# EAGLE design JJ BLDC v0.2b (EAGLE 7.2.0)
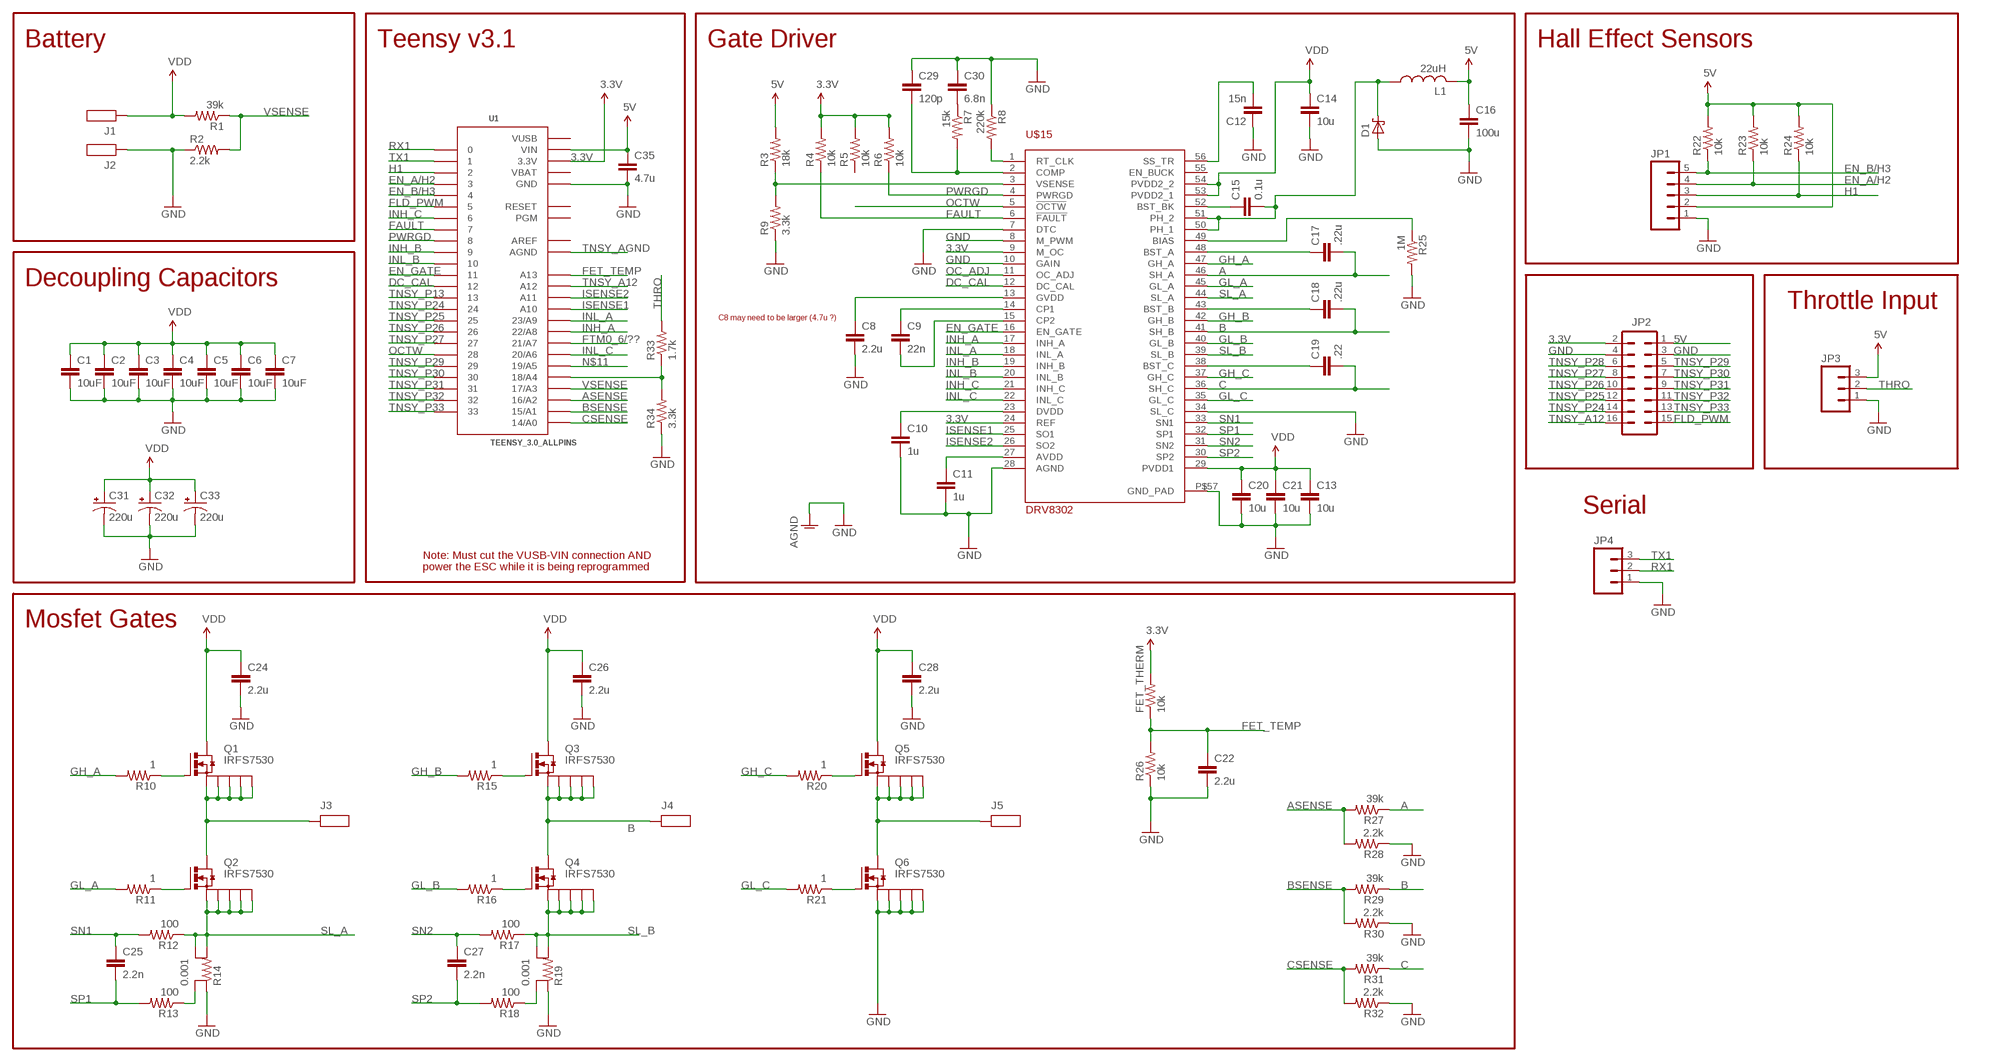
[diagram p0: schematic, sheet 1]

## Parts
C1  10uF  CAP1206  [1206]
C2  10uF  CAP1206  [1206]
C3  10uF  CAP1206  [1206]
C4  10uF  CAP1206  [1206]
C5  10uF  CAP1206  [1206]
C6  10uF  CAP1206  [1206]
C7  10uF  CAP1206  [1206]
C8  2.2u  CAP0603-CAP  [0603-CAP]
C9  22n  CAP0603-CAP  [0603-CAP]
C10  1u  CAP0603-CAP  [0603-CAP]
C11  1u  CAP0603-CAP  [0603-CAP]
C12  15n  CAP0603-CAP  [0603-CAP]
C13  10u  CAP0805  [0805]
C14  10u  CAP0805  [0805]
C15  0.1u  CAP0603-CAP  [0603-CAP]
C16  100u  CAP0805  [0805]
C17  .22u  CAP0603-CAP  [0603-CAP]
C18  .22u  CAP0603-CAP  [0603-CAP]
C19  .22  CAP0603-CAP  [0603-CAP]
C20  10u  CAP0603-CAP  [0603-CAP]
C21  10u  CAP0805  [0805]
C22  2.2u  CAP0603-CAP  [0603-CAP]
C24  2.2u  CAP1206  [1206]
C25  2.2n  CAP0603-CAP  [0603-CAP]
C26  2.2u  CAP1206  [1206]
C27  2.2n  CAP0603-CAP  [0603-CAP]
C28  2.2u  CAP1206  [1206]
C29  120p  CAP0603-CAP  [0603-CAP]
C30  6.8n  CAP0603-CAP  [0603-CAP]
C31  220u  CPOL-USE5-10.5  [E5-10,5]
C32  220u  CPOL-USE5-10.5  [E5-10,5]
C33  220u  CPOL-USE5-10.5  [E5-10,5]
C35  4.7u  CAP0603-CAP  [0603-CAP]
D1  SCHOTTKY_SMA  [SMA]
FET_THERM  10k  RESISTOR0603  [0603-RES]
J1  WIREPAD_SMD_10X4  [WIREPAD_SMD_10X4]
J2  WIREPAD_SMD_10X4  [WIREPAD_SMD_10X4]
J3  WIREPAD_SMD_10X4  [WIREPAD_SMD_10X4]
J4  WIREPAD_SMD_10X4  [WIREPAD_SMD_10X4]
J5  WIREPAD_SMD_10X4  [WIREPAD_SMD_10X4]
JP1  M05PTH  [1X05]
JP2  M08X2  [2X8]
JP3  M03PTH  [1X03]
JP4  M03PTH  [1X03]
L1  22uH  L-USL5650M  [L5650M]
Q1  IRFS7530  [TO-263-7]
Q2  IRFS7530  [TO-263-7]
Q3  IRFS7530  [TO-263-7]
Q4  IRFS7530  [TO-263-7]
Q5  IRFS7530  [TO-263-7]
Q6  IRFS7530  [TO-263-7]
R1  39k  RESISTOR0603  [0603-RES]
R2  2.2k  RESISTOR0603  [0603-RES]
R3  18k  RESISTOR0603  [0603-RES]
R4  10k  RESISTOR0603  [0603-RES]
R5  10k  RESISTOR0603  [0603-RES]
R6  10k  RESISTOR0603  [0603-RES]
R7  15k  RESISTOR0603  [0603-RES]
R8  220k  RESISTOR0603  [0603-RES]
R9  3.3k  RESISTOR0603  [0603-RES]
R10  1  RESISTOR0603  [0603-RES]
R11  1  RESISTOR0603  [0603-RES]
R12  100  RESISTOR0603  [0603-RES]
R13  100  RESISTOR0603  [0603-RES]
R14  0.001  WSLP2726_SHUNT  [SHUNT-RES-2726]
R15  1  RESISTOR0603  [0603-RES]
R16  1  RESISTOR0603  [0603-RES]
R17  100  RESISTOR0603  [0603-RES]
R18  100  RESISTOR0603  [0603-RES]
R19  0.001  WSLP2726_SHUNT  [SHUNT-RES-2726]
R20  1  RESISTOR0603  [0603-RES]
R21  1  RESISTOR0603  [0603-RES]
R22  10k  RESISTOR0603  [0603-RES]
R23  10k  RESISTOR0603  [0603-RES]
R24  10k  RESISTOR0603  [0603-RES]
R25  1M  RESISTOR0603  [0603-RES]
R26  10k  RESISTOR0603  [0603-RES]
R27  39k  RESISTOR0603  [0603-RES]
R28  2.2k  RESISTOR0603  [0603-RES]
R29  39k  RESISTOR0603  [0603-RES]
R30  2.2k  RESISTOR0603  [0603-RES]
R31  39k  RESISTOR0603  [0603-RES]
R32  2.2k  RESISTOR0603  [0603-RES]
R33  1.7k  RESISTOR0603  [0603-RES]
R34  3.3k  RESISTOR0603  [0603-RES]
U1  TEENSY_3.0_ALLPINS  [TEENSY_3.0_ALLPINS]
U$15  DRV8302  [HTSSOP-56]

## Nets
3.3V: FET_THERM.2 JP2.2 R4.2 R5.2 R6.2 U1.3.3V U1.3.3V1(3.3V) U1.3.3V2(3.3V) U$15.9(M_OC) U$15.24(REF)
5V: C16.1 C35.1 JP1.2 JP2.1 JP3.3 L1.2 R3.2 R22.2 R23.2 R24.2 U1.VIN
A: C17.2 J3.P$1 Q1.2(S1) Q1.3(S2) Q1.5(S3) Q1.6(S4) Q1.7(S) Q2.4(D) R27.1 U$15.46(SH_A)
ASENSE: R27.2 R28.2 U1.16/A2
B: C18.2 J4.P$1 Q3.2(S1) Q3.3(S2) Q3.5(S3) Q3.6(S4) Q3.7(S) Q4.4(D) R29.1 U$15.41(SH_B)
BSENSE: R29.2 R30.2 U1.15/A1
C: C19.2 J5.P$1 Q5.2(S1) Q5.3(S2) Q5.5(S3) Q5.6(S4) Q5.7(S) Q6.4(D) R31.1 U$15.36(SH_C)
CSENSE: R31.2 R32.2 U1.14/A0
DC_CAL: U1.12 U$15.12(DC_CAL)
EN_A/H2: JP1.4 R23.1 U1.3
EN_B/H3: JP1.5 R22.1 U1.4
EN_GATE: U1.11 U$15.16(EN_GATE)
FAULT: R4.1 U1.7 U$15.6(!FAULT)
FET_TEMP: C22.1 FET_THERM.1 R26.2 U1.A13
FLD_PWM: JP2.15 U1.5
FTM0_6/??: U1.21/A7
GH_A: R10.2 U$15.47(GH_A)
GH_B: R15.2 U$15.42(GH_B)
GH_C: R20.2 U$15.37(GH_C)
GL_A: R11.2 U$15.45(GL_A)
GL_A': Q2.1(G) R11.1
GL_B: R16.2 U$15.40(GL_B)
GL_B': Q4.1(G) R16.1
GL_C: R21.2 U$15.35(GL_C)
GL_C': Q6.1(G) R21.1
GND: C1.2 C2.2 C3.2 C4.2 C5.2 C6.2 C7.2 C8.2 C10.2 C11.2 C12.1 C13.2 C14.2 C16.2 C20.2 C21.2 C22.2 C24.2 C26.2 C28.2 C29.1 C30.1 C31.- C32.- C33.- C35.2 D1.A J2.P$1 JP1.1 JP2.3 JP2.4 JP3.1 JP4.1 Q6.2(S1) Q6.3(S2) Q6.5(S3) Q6.6(S4) Q6.7(S) R2.1 R8.1 R9.1 R14.P$1 R19.P$1 R25.2 R26.1 R28.1 R30.1 R32.1 R34.1 U1.GND U1.GND1(GND) U1.GND2(GND) U$15.7(DTC) U$15.8(M_PWM) U$15.10(GAIN) U$15.28(AGND) U$15.34(SL_C) U$15.P$57(GND_PAD) ; supply symbol labelled AGND
H1: JP1.3 R24.1 U1.2
INH_A: U1.22/A8 U$15.17(INH_A)
INH_B: U1.9 U$15.19(INH_B)
INH_C: U1.6 U$15.21(INH_C)
INL_A: U1.23/A9 U$15.18(INL_A)
INL_B: U1.10 U$15.20(INL_B)
INL_C: U1.20/A6 U$15.22(INL_C)
ISENSE1: U1.A10 U$15.25(SO1)
ISENSE2: U1.A11 U$15.26(SO2)
N$1: Q3.1(G) R15.1
N$2: R3.1 R9.2 U$15.3(VSENSE)
N$3: C29.2 R7.2 U$15.2(COMP)
N$4: C10.1 U$15.23(DVDD)
N$5: Q5.1(G) R20.1
N$6: C12.2 U$15.56(SS_TR)
N$7: C30.2 R7.1
N$8: C15.1 U$15.52(BST_BK)
N$9: Q1.1(G) R10.1
N$10: R8.2 U$15.1(RT_CLK)
N$11: U1.19/A5
N$12: R25.1 U$15.49(BIAS)
N$13: R33.1 R34.2 U1.18/A4
N$15: R13.1 R14.P$3
N$16: R18.1 R19.P$3
N$28: C19.1 U$15.38(BST_C)
N$30: C9.1 U$15.14(CP1)
N$31: C11.1 U$15.27(AVDD)
N$32: C9.2 U$15.15(CP2)
N$33: C8.1 U$15.13(GVDD)
N$34: C18.1 U$15.43(BST_B)
N$44: C17.1 U$15.48(BST_A)
N$47: C15.2 D1.C L1.1 U$15.50(PH_1) U$15.51(PH_2)
OC_ADJ: U$15.11(OC_ADJ)
OCTW: U1.28 U$15.5(!OCTW)
PWRGD: R6.1 U1.8 U$15.4(PWRGD)
RX1: JP4.2 U1.0
SL_A: Q2.2(S1) Q2.3(S2) Q2.5(S3) Q2.6(S4) Q2.7(S) R12.1 R14.P$2 R14.P$4 U$15.44(SL_A)
SL_B: Q4.2(S1) Q4.3(S2) Q4.5(S3) Q4.6(S4) Q4.7(S) R17.1 R19.P$2 R19.P$4 U$15.39(SL_B)
SN1: C25.1 R12.2 U$15.33(SN1)
SN2: C27.1 R17.2 U$15.31(SN2)
SP1: C25.2 R13.2 U$15.32(SP1)
SP2: C27.2 R18.2 U$15.30(SP2)
THRO: JP3.2 R33.2
TNSY_A12: JP2.16 U1.A12
TNSY_AGND: U1.AGND
TNSY_P13: U1.13
TNSY_P24: JP2.14 U1.24
TNSY_P25: JP2.12 U1.25
TNSY_P26: JP2.10 U1.26
TNSY_P27: JP2.8 U1.27
TNSY_P28: JP2.6
TNSY_P29: JP2.5 U1.29
TNSY_P30: JP2.7 U1.30
TNSY_P31: JP2.9 U1.31
TNSY_P32: JP2.11 U1.32
TNSY_P33: JP2.13 U1.33
TX1: JP4.3 U1.1
VDD: C1.1 C2.1 C3.1 C4.1 C5.1 C6.1 C7.1 C13.1 C14.1 C20.1 C21.1 C24.1 C26.1 C28.1 C31.+ C32.+ C33.+ J1.P$1 Q1.4(D) Q3.4(D) Q5.4(D) R1.2 U$15.29(PVDD1) U$15.53(PVDD2_1) U$15.54(PVDD2_2)
VSENSE: R1.1 R2.2 U1.17/A3
Unconnected: R5.1 U1.PGM U1.RESET U$15.55(EN_BUCK)

## Notes on the sheet
- Battery | Teensy v3.1 | Gate Driver | Hall Effect Sensors
- Decoupling Capacitors
- Throttle Input
- C8 may need to be larger (4.7u ?)
- Serial
- Note: Must cut the VUSB-VIN connection AND
- power the ESC while it is being reprogrammed
- Mosfet Gates

## Power pins joined to a net without a drawn wire
AREF: U1.AREF
VBAT: U1.VBAT
VUSB: U1.VUSB

## Library data of the parts
C1-C22 C24-C30 C35 = SparkFun-Capacitors:CAP: Capacitor Standard 0603 ceramic capacitor, and 0.1" leaded capacitor.
C31-C33 = rcl:CPOL-US: POLARIZED CAPACITOR, American symbol
D1 = sc_usercreated:SCHOTTKY_SMA
FET_THERM R1-R13 R15-R18 R20-R34 = SparkFun-Resistors:RESISTOR: Resistor Basic schematic elements and footprints for 0603, 1206, and PTH resistors.
J1-J5 = PikiTech:WIREPAD_SMD_10X4
JP1 = SparkFun-Connectors:M05: Header 5 Standard 5-pin 0.1" header. Use with straight break away headers (SKU : PRT-00116), right angle break away headers (PRT-00553), swiss pins (PRT-00743), machine pins (PRT-00117), and female headers (PRT-00115). Molex polarized connector foot print use with SKU : PRT-08230 with associated crimp pins and housings.
JP2 = SparkFun-Connectors:M08X2: .1" headers, two rows of 8 each
JP3 JP4 = SparkFun-Connectors:M03: Header 3 Standard 3-pin 0.1" header. Use with straight break away headers (SKU : PRT-00116), right angle break away headers (PRT-00553), swiss pins (PRT-00743), machine pins (PRT-00117), and female headers (PRT-00115). Molex polarized connector foot print use with SKU : PRT-08232 with associated crimp pins and housings.
L1 = rcl:L-US: INDUCTOR, American symbol
Q1-Q6 = PikiTech:IRFS7530: IRFS7530 HEXFET Power MOSFET ***UNTESTED***
R14 R19 = PikiTech:WSLP2726_SHUNT
U1 = Teensy3.0:TEENSY_3.0_ALLPINS: Teensy 3.0 with all pin holes and optional SMD-mount unshrouded header on bottom of Teensy 3.0. For more basic versions, see 'Basic', '+4' and 'AllAnalogPins'. Requires the installation of a un-shrouded SMD header on the underside of the Teensy 3.0
U$15 = PikiTech:DRV8302: Three Phase Pre-Driver with Dual Current Shunt Amplifiers and Buck Regulator – Hardware Controlled

## Board
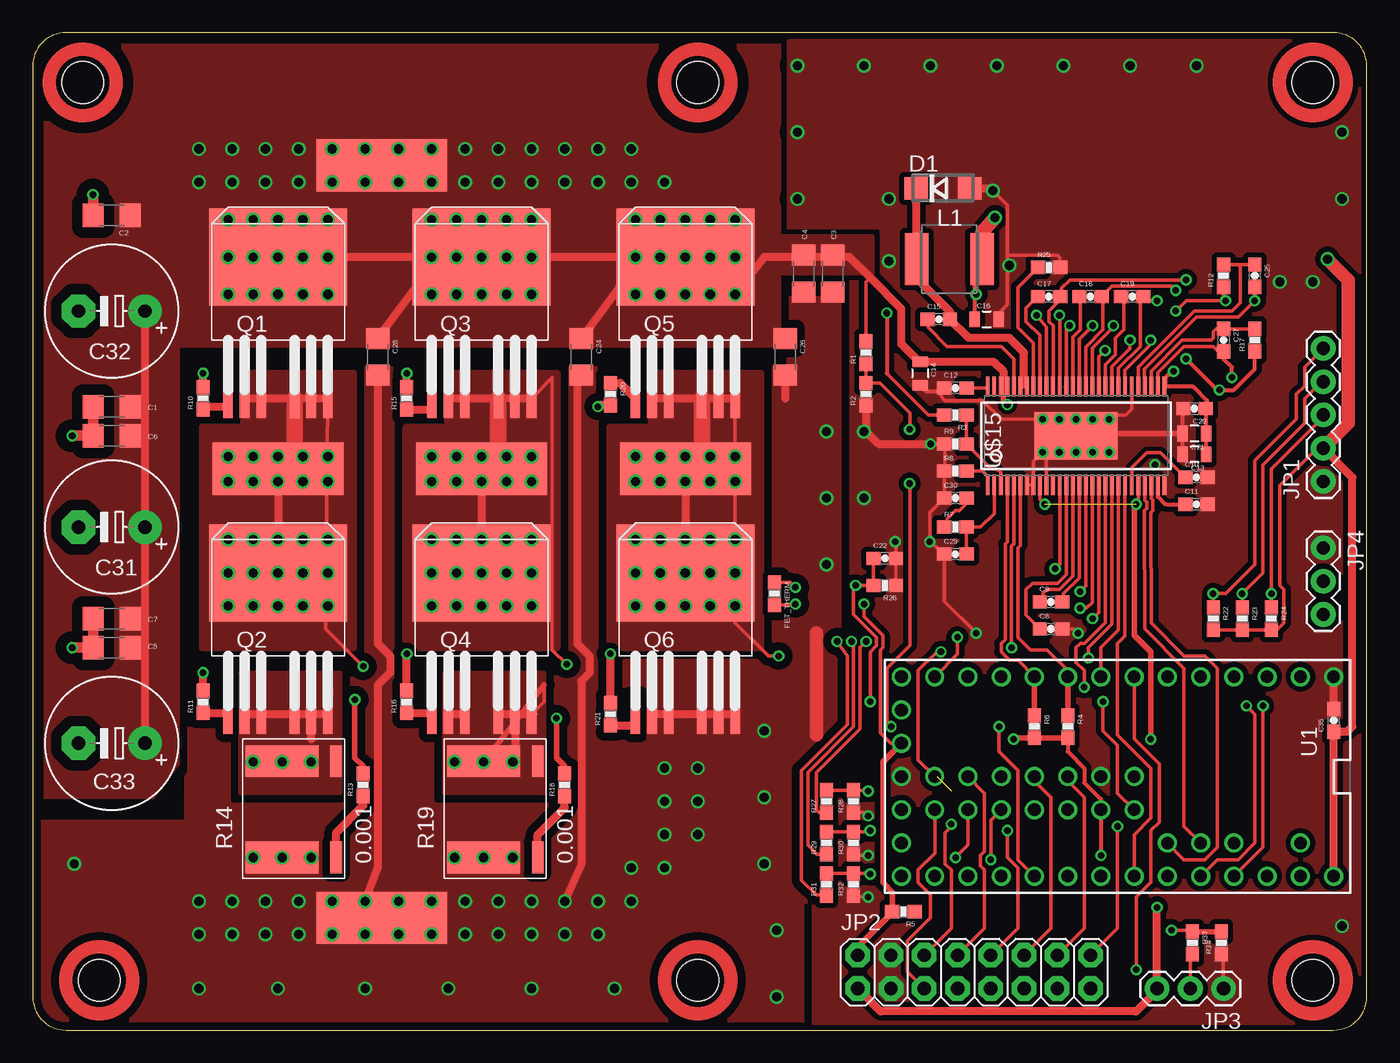
[diagram p1: board, top side]
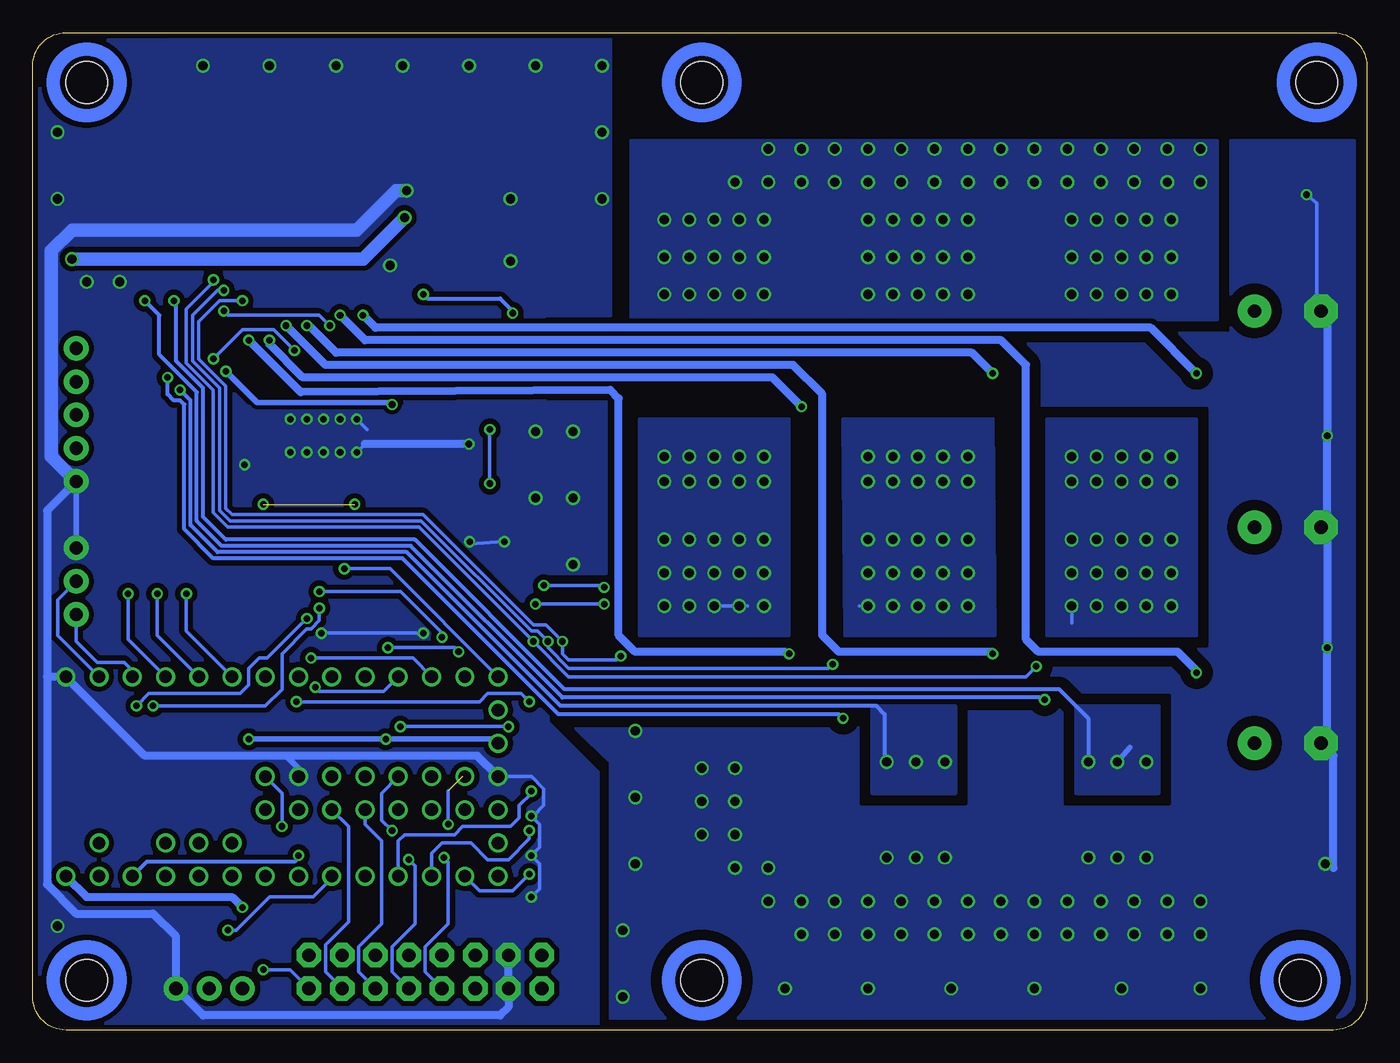
[diagram p2: board, bottom side, seen from below]

Size 101.91 x 76.19 mm. Coordinates in mm from the lower left corner, seen from the top.
Outline: 0,73.65 0,2.54 arc90 2.54,0 99.36,0 arc90 101.91,2.54 101.91,73.65 arc90 99.36,76.19 2.54,76.19 arc90 0,73.65
Copper layers (1*16): Top 0.0356mm / dielectric 1.5011mm / Bottom 0.0356mm
Design rules "LaenPCBOrder *": minimum track width 6mil, minimum drill 13mil, track to track 6mil, track to pad 6mil, pad to pad 6mil, via to via 6mil, smd to smd 0mil, copper to edge 15mil, drill to drill 6mil, minimum pad ring 7mil, minimum via ring 7mil, stop-mask expansion 3mil, vias tented up to drill 0mil, thermal gap 10mil
Holes 3.2 mm at 3.81,72.39 50.8,72.39 97.79,72.39 97.79,3.81 50.8,3.81 5.08,3.81

### Footprints (pad centres in the part's own frame; a part is rotated, then mirrored left to right if it is on the bottom)
1206 = smd 1.6 x 1.8: 1 -1.4,0; 2 1.4,0
0603-CAP = smd 1.1 x 1: 1 -0.85,0; 2 0.85,0
0805 = smd 0.8 x 1.2: 1 -0.9,0; 2 0.9,0
E5-10,5 = drill 1.016 pad 2.54: + -2.54,0 | drill 1.016 pad 2.54 octagon: - 2.54,0
SMA = smd 1.8 x 1.7: A 2.05,0; C -2.05,0
0603-RES = smd 1.1 x 1: 1 -0.85,0; 2 0.85,0
WIREPAD_SMD_10X4 = smd 10 x 4: P$1 0,0
1X05 = drill 1.016 pad 1.88: 1 0,0; 2 2.54,0; 3 5.08,0; 4 7.62,0; 5 10.16,0
2X8 = drill 1.016 pad 1.88 octagon: 1 0,0; 2 0,2.54; 3 2.54,0; 4 2.54,2.54; 5 5.08,0; 6 5.08,2.54; 7 7.62,0; 8 7.62,2.54; 9 10.16,0; 10 10.16,2.54; 11 12.7,0; 12 12.7,2.54; 13 15.24,0; 14 15.24,2.54; 15 17.78,0; 16 17.78,2.54
1X03 = drill 1.016 pad 1.88: 1 0,0; 2 2.54,0; 3 5.08,0
L5650M = smd 1.8 x 4: 1 -2.5,0; 2 2.5,0
TO-263-7 = smd 0.737 x 3.048: 1 -3.81,-6.985; 2 -2.54,-6.985; 3 -1.27,-6.985; 5 1.27,-6.985; 6 2.54,-6.985; 7 3.81,-6.985 | smd 10.541 x 7.417: 4 0,3.81
SHUNT-RES-2726 = smd 5.588 x 2.438: P$1 -0.635,-3.81; P$2 -0.635,3.556 | smd 0.889 x 2.438: P$3 3.493,-3.81; P$4 3.493,3.556
TEENSY_3.0_ALLPINS = drill 0.965: 0 -7.62,13.97; 1 -7.62,11.43; 2 -7.62,8.89; 3 -7.62,6.35; 3.3V 7.62,11.43; 3.3V1 -2.54,-16.51; 3.3V2 2.54,-1.27; 4 -7.62,3.81; 5 -7.62,1.27; 6 -7.62,-1.27; 7 -7.62,-3.81; 8 -7.62,-6.35; 9 -7.62,-8.89; 10 -7.62,-11.43; 11 -7.62,-13.97; 12 -7.62,-16.51; 13 7.62,-16.51; 14/A0 7.62,-13.97; 15/A1 7.62,-11.43; 16/A2 7.62,-8.89; 17/A3 7.62,-6.35; 18/A4 7.62,-3.81; 19/A5 7.62,-1.27; 20/A6 7.62,1.27; 21/A7 7.62,3.81; 22/A8 7.62,6.35; 23/A9 7.62,8.89; 24 0,-3.81; 25 0,-6.35; 26 0,-8.89; 27 0,-11.43; 28 0,-13.97; 29 2.54,-13.97; 30 2.54,-11.43; 31 2.54,-8.89; 32 2.54,-6.35; 33 2.54,-3.81; A10 5.08,6.35; A11 5.08,3.81; A12 0,1.27; A13 2.54,1.27; AGND 7.62,13.97; AREF 5.08,8.89; GND -7.62,16.51; GND1 0,-16.51; GND2 0,-1.27; PGM 2.54,-16.51; RESET 5.08,-16.51; VBAT -5.08,-16.51; VIN 7.62,16.51; VUSB 5.08,13.97
HTSSOP-56 = smd 0.3 x 1.55: 1 -6.75,-3.75; 2 -6.25,-3.75; 3 -5.75,-3.75; 4 -5.25,-3.75; 5 -4.75,-3.75; 6 -4.25,-3.75; 7 -3.75,-3.75; 8 -3.25,-3.75; 9 -2.75,-3.75; 10 -2.25,-3.75; 11 -1.75,-3.75; 12 -1.25,-3.75; 13 -0.75,-3.75; 14 -0.25,-3.75; 15 0.25,-3.75; 16 0.75,-3.75; 17 1.25,-3.75; 18 1.75,-3.75; 19 2.25,-3.75; 20 2.75,-3.75; 21 3.25,-3.75; 22 3.75,-3.75; 23 4.25,-3.75; 24 4.75,-3.75; 25 5.25,-3.75; 26 5.75,-3.75; 27 6.25,-3.75; 28 6.75,-3.75; 29 6.75,3.75; 30 6.25,3.75; 31 5.75,3.75; 32 5.25,3.75; 33 4.75,3.75; 34 4.25,3.75; 35 3.75,3.75; 36 3.25,3.75; 37 2.75,3.75; 38 2.25,3.75; 39 1.75,3.75; 40 1.25,3.75; 41 0.75,3.75; 42 0.25,3.75; 43 -0.25,3.75; 44 -0.75,3.75; 45 -1.25,3.75; 46 -1.75,3.75; 47 -2.25,3.75; 48 -2.75,3.75; 49 -3.25,3.75; 50 -3.75,3.75; 51 -4.25,3.75; 52 -4.75,3.75; 53 -5.25,3.75; 54 -5.75,3.75; 55 -6.25,3.75; 56 -6.75,3.75 | smd 6.35 x 3.61: P$57 0,0

### Placement (x,y rotation side)
C1  6.03,47.62 180 top
C2  6.03,62.23 180 top
C3  61.12,57.78 270 top
C4  58.9,57.78 270 top
C5  6.03,29.21 180 top
C6  6.03,45.4 180 top
C7  6.03,31.43 180 top
C8  77.79,30.64 0 top
C9  77.79,32.7 0 top
C10  88.9,42.23 0 top
C11  88.9,40.16 0 top
C12  70.48,49.05 0 top
C13  88.74,43.97 180 top
C14  67.79,50.16 270 top
C15  69.22,54.29 0 top
C16  72.87,54.29 0 top
C17  77.63,56.04 0 top
C18  80.8,56.04 0 top
C19  83.98,56.04 0 top
C20  88.74,47.47 180 top
C21  88.74,45.56 180 top
C22  65.09,36.04 0 top
C24  41.91,51.44 270 top
C25  93.34,57.63 270 top
C26  57.47,51.44 270 top
C27  90.96,52.7 270 top
C28  26.35,51.44 270 top
C29  70.48,36.35 0 top
C30  70.48,40.64 0 top
C31  6.03,38.42 180 top
C32  6.03,54.93 180 top
C33  6.03,21.91 180 top
C35  99.38,23.65 90 top
D1  69.53,64.29 0 top
FET_THERM  56.67,33.34 270 top
J1  26.67,66.04 0 top
J2  26.67,8.57 0 top
J3  18.73,42.86 0 top
J4  34.29,42.86 0 top
J5  49.85,42.86 0 top
JP1  98.58,41.91 90 top
JP2  63.02,3.17 0 top
JP3  90.96,3.17 180 top
JP4  98.58,36.83 270 top
L1  70.01,58.9 0 top
Q1  18.73,55.24 0 top
Q2  18.73,31.11 0 top
Q3  34.29,55.24 0 top
Q4  34.29,31.11 0 top
Q5  49.85,55.24 0 top
Q6  49.85,31.11 0 top
R1  63.66,51.75 90 top
R2  63.66,48.58 90 top
R3  70.48,46.99 180 top
R4  79.06,23.18 270 top
R5  66.52,9.05 180 top
R6  76.52,23.18 270 top
R7  70.48,38.42 0 top
R8  70.48,42.7 0 top
R9  70.48,44.77 0 top
R10  13.02,48.26 90 top
R11  13.02,25.08 90 top
R12  90.96,57.63 90 top
R13  25.24,18.73 90 top
R14  19.68,16.99 0 top
R15  28.57,48.26 90 top
R16  28.57,25.08 90 top
R17  93.34,52.7 90 top
R18  40.64,18.73 90 top
R19  35.08,16.99 0 top
R20  44.13,48.58 270 top
R21  44.13,24.13 90 top
R22  90.17,31.43 270 top
R23  92.39,31.43 270 top
R24  94.61,31.43 270 top
R25  77.63,58.26 0 top
R26  65.09,33.97 180 top
R27  60.64,17.46 90 top
R28  62.71,17.46 90 top
R29  60.64,14.29 90 top
R30  62.71,14.29 90 top
R31  60.64,11.11 90 top
R32  62.71,11.11 90 top
R33  88.58,6.67 270 top
R34  90.81,6.67 90 top
U1  82.87,19.37 270 top
U$15  79.69,45.4 0 top

### Tracks (layer width: path | path; a pad name or v marks a point on that pad's centre or on a via)
3.3V  (via drill 0.5)  (1 unrouted)
  Top 0.254: U$15.9 76.94,40.53 v77.31,40.16 | 84.45,41.64 84.45,40.32 v84.3,40.16 | U1.3.3V1 65.56,21.91 64.77,22.7 64.77,29.05 64.93,29.21 64.93,30.16 63.5,31.59 v63.5,32.54 | FET_THERM.2 58.2,32.49 v58.26,32.54
  Top 0.305: U$15.24 84.45,41.64 | R4.2 79.06,21.27 80.33,20 80.33,18.89 81.6,17.62 U1.3.3V2 v81.6,13.34
  Top 0.406: R4.2 R6.2 75.03,22.33 v74.93,22.23 | v85.41,22.23 85.41,28.89 84.14,30.16 84.14,40.01 v84.3,40.16 | U1.3.3V1 64.93,20.48 64.93,11.27 65.67,10.53 R5.2 65.67,8.99 63.02,6.35 JP2.2
  Bottom 0.254: v58.26,32.54 v63.5,32.54
  Bottom 0.305: v81.6,13.34 81.6,13.18 81.92,12.86 93.19,12.86 U1.3.3V
  Bottom 0.406: U1.3.3V1 66.67,22.23 v74.93,22.23 v85.41,22.23
5V  (via drill 0.5, 0.7)
  Top 0.254: C16.1 71.97,58.35 L1.2 | R22.2 R23.2 R24.2 95.03,30.58 95.57,31.11 95.57,33.66 95.25,33.97 95.25,41.59 98.11,44.45 JP1.2 | R3.2 68.42,46.99 65.25,50.16
  Top 0.305: C16.1 71.97,57.36 72.07,57.47 | 72.39,57.78 72.07,57.47 | 72.07,57.47 v72.07,56.2 | v65.25,54.77 65.25,50.16
  Top 0.61: L1.2 72.51,60.92 | U1.VIN C35.1 100.43,22.8 100.81,23.18 100.81,42.23 JP1.2 | v85.88,9.37 JP3.3 85.88,3.02 84.3,1.43 64.77,1.43 JP2.1
  Top 1.016: 72.51,60.92 v73.5,62.07 | JP1.2 100.49,46.35 100.49,57.31 v98.9,58.9
  Bottom 0.305: v72.07,56.2 71.75,55.88 66.2,55.88 65.25,54.93 v65.25,54.77
  Bottom 0.61: U1.VIN 97.79,10.16 86.68,10.16 v85.88,9.37
  Bottom 1.016: v73.5,62.07 76.68,58.9 v98.9,58.9
A  (via drill 0.5, 0.7)
  Top 0.254: Q1.7 22.38,30.64 v25.24,27.78 | U$15.46 77.95,53.82 77.63,54.13 77.63,54.93 78.48,55.78 C17.2 78.58,56.14 78.58,56.67 79.22,57.31 v88.11,57.31 | R27.1 60.06,16.61 59.85,16.83 59.85,19.68 63.18,23.02 63.18,29.21 v63.66,29.69
  Top 0.305: 78.74,55.78 C17.2
  Top 0.61: Q1.7 Q1.6 Q1.5 Q1.3 Q1.2 | J3.P$1 Q2.4
  Top 1.27: Q1.5 20,43.81 J3.P$1
  Bottom 0.254: v22.54,32.38 22.54,31.11 | v25.24,27.78 26.04,26.99 60.96,26.99 v63.66,29.69 72.39,38.42 87,38.42 88.11,39.53 88.11,48.9 90.17,50.96 90.17,55.09 88.11,57.15 v88.11,57.31
  other vias: 22.54,43.81 22.54,41.91 20.64,41.91 18.73,41.91 16.83,41.91 14.92,41.91 20.64,43.81 18.73,43.81 16.83,43.81 14.92,43.81 22.54,37.47 22.54,34.92 20.64,32.38 20.64,34.92 20.64,37.47 18.73,37.47 18.73,34.92 18.73,32.38 16.83,32.38 14.92,32.38 14.92,34.92 16.83,34.92 16.83,37.47 14.92,37.47
  pour Top (isolate 0.406, no thermals): 13.02,29.21 13.02,46.04 16.19,46.04 16.19,50.16 24.45,50.16 24.45,29.21
  pour Bottom (isolate 0.305): 24.45,46.67 24.45,30.16 13.02,30.16 13.02,46.67
ASENSE  (via drill 0.5)
  Top 0.254: R27.2 R28.2 63.82,18.31 v63.82,18.26
  Bottom 0.254: v63.82,18.26 63.82,18.1 64.77,17.14 64.77,16.19 65.41,15.56 69.06,15.56 69.69,14.92 73.5,14.92 73.98,14.45 U1.16/A2
B  (via drill 0.5, 0.7)
  Top 0.254: Q3.7 39.69,49.85 39.69,29.05 v40.8,27.94 | U$15.41 80.44,52.19 81.76,53.5 81.76,55.94 C18.2 | 81.92,55.78 C18.2 | C18.2 82.45,56.83 87,56.83 v87.31,56.52 | R29.1 59.91,13.44 59.21,14.13 59.21,19.68 62.71,23.18 62.71,29.53 v62.55,29.69
  Top 0.305: 81.28,55.98 C18.2
  Top 0.61: Q3.7 Q3.6 Q3.5 Q3.3 Q3.2 | J4.P$1 34.29,34.29
  Top 1.27: Q3.5 35.56,43.81 J4.P$1
  Bottom 0.254: v38.1,32.38 38.73,32.38 | v40.8,27.94 41.12,27.62 60.96,27.62 62.55,29.21 v62.55,29.69 63.34,30.48 63.82,30.48 72.23,38.89 86.84,38.89 87.63,39.69 87.63,49.05 89.69,51.12 89.69,54.61 87.79,56.52 v87.31,56.52
  other vias: 38.1,43.81 38.1,41.91 36.2,41.91 36.2,43.81 34.29,43.81 30.48,43.81 32.38,43.81 34.29,41.91 32.38,41.91 30.48,41.91 38.1,37.47 38.1,34.92 36.2,32.38 36.2,34.92 36.2,37.47 34.29,37.47 34.29,34.92 34.29,32.38 32.38,32.38 32.38,34.92 32.38,37.47 30.48,37.47 30.48,34.92 30.48,32.38
  pour Top (isolate 0.406, no thermals): 28.57,29.21 28.57,46.04 31.75,46.04 31.75,50.16 40.01,50.16 40.01,29.21
  pour Bottom (isolate 0.305): 40.01,46.67 39.85,30.16 28.42,30.16 28.57,46.67
BSENSE  (via drill 0.5)
  Top 0.254: R29.2 R30.2 63.72,15.14 v63.98,15.24
  Bottom 0.254: v63.98,15.24 63.98,14.61 65.56,13.02 67.15,13.02 68.42,14.29 70.64,14.29 71.44,13.49 U1.15/A1
C  (via drill 0.5, 0.7)
  Top 0.254: Q5.7 53.66,31.11 56.2,28.57 v56.99,28.57 | 84.77,55.98 84.77,56.04 84.61,55.72 84.61,52.23 82.94,50.56 U$15.36 | 84.99,56.2 C19.2 85.15,55.72 v85.88,55.72 | R31.1 60.59,10.32 59.85,10.32 58.74,11.43 58.74,19.84 62.23,23.34 62.23,28.57 v61.44,29.69
  Top 0.305: 84.77,55.98 C19.2
  Top 0.61: Q5.7 Q5.6 Q5.5 Q5.3 Q5.2 | J5.P$1 Q6.4
  Top 1.27: Q5.5 51.12,43.81 J5.P$1
  Bottom 0.254: v49.85,32.38 47.31,32.38 | v56.99,28.57 57.31,28.26 60.96,28.26 61.44,28.73 v61.44,29.69 62.71,30.96 63.66,30.96 72.07,39.37 86.68,39.37 87.15,39.85 87.15,49.21 89.22,51.28 89.22,54.13 87.63,55.72 v85.88,55.72
  other vias: 53.66,43.81 51.75,43.81 49.85,43.81 47.94,43.81 46.04,43.81 46.04,41.91 47.94,41.91 49.85,41.91 51.75,41.91 53.66,41.91 53.66,37.47 53.66,34.92 53.66,32.38 51.75,32.38 51.75,34.92 51.75,37.47 49.85,34.92 49.85,37.47 47.94,37.47 47.94,34.92 47.94,32.38 46.04,32.38 46.04,34.92 46.04,37.47
  pour Top (isolate 0.406, no thermals): 44.13,29.21 44.13,46.04 47.31,46.04 47.31,50.16 55.56,50.16 55.56,29.21
  pour Bottom (isolate 0.305): 55.56,46.67 55.56,30.16 44.13,30.16 44.13,46.67
CSENSE  (via drill 0.5)
  Top 0.254: R31.2 R32.2 63.92,11.96 v63.98,11.91
  Bottom 0.254: v63.98,11.91 65.25,10.64 67.79,10.64 U1.14/A0
DC_CAL  (via drill 0.5)
  Top 0.254: U$15.12 78.44,35.58 v78.11,35.24
  Bottom 0.254: v78.11,35.24 74.61,35.24 U1.12
EN_A/H2  (via drill 0.5)
  Top 0.254: R23.1 v92.39,33.34 93.98,34.92 93.98,43.18 97.16,46.35 97.16,48.26 98.42,49.53 JP1.4
  Bottom 0.254: U1.3 92.39,30.16 v92.39,33.34
EN_B/H3  (via drill 0.5)
  Top 0.254: R22.1 v90.17,33.34 91.12,33.34 93.34,35.56 93.34,43.5 96.52,46.67 96.52,48.58 97.16,49.21 97.16,50.64 JP1.5
  Bottom 0.254: U1.4 90.17,30.48 v90.17,33.34
EN_GATE  (via drill 0.5)
  Top 0.254: U$15.16 80.44,33.93 v80.01,33.5 | v70.64,30 70.64,28.73 U1.11
  Bottom 0.254: v80.01,33.5 73.82,33.5 70.64,30.32 v70.64,30
FAULT
  Top 0.254: U$15.6 75.44,37.02 75.25,36.83 75.25,30 76.2,29.05 77.47,29.05 79.06,27.46 U1.7
  Top 0.406: U1.7 R4.1
FET_TEMP  (via drill 0.5)
  Top 0.254: FET_THERM.1 57.89,34.19 v58.26,33.81 | C22.1 R26.2 v62.87,33.97 62.71,33.81 62.71,31.75 64.45,30 64.45,29.37 63.98,28.89 v63.98,25.08 | U1.A13 82.87,18.1 82.87,21.75 81.76,22.86 v81.76,25.08
  Bottom 0.254: 58.26,34.13 v58.26,33.81 58.42,33.97 v62.87,33.97 | v81.76,25.08 67.79,25.08 67.15,25.72 64.61,25.72 v63.98,25.08
FLD_PWM  (via drill 0.5)
  Top 0.254: U1.5 84.14,22.23 86.04,20.32 86.04,15.88 85.41,15.24 85.41,11.27 84.3,10.16 v84.3,4.6
  Bottom 0.254: v84.3,4.6 82.23,4.6 JP2.15
GH_A  (via drill 0.5)
  Top 0.254: 77.47,49.18 U$15.47 77.44,53.69 v76.68,54.61
  Top 0.61: R10.2 v13.02,50.16
  Bottom 0.61: v13.02,50.16 16.51,53.66 75.72,53.66 v76.68,54.61
GH_B  (via drill 0.5)
  Top 0.254: U$15.42 79.94,52.8 v80.96,53.82
  Top 0.61: R15.2 v28.57,50.16
  Bottom 0.61: v28.57,50.16 30.16,51.75 78.74,51.75 80.8,53.82 v80.96,53.82
GH_C  (via drill 0.5)
  Top 0.254: U$15.37 82.44,50.69 83.82,52.07 v83.82,52.7
  Top 0.61: R20.2 43.28,47.73 v43.18,47.62
  Bottom 0.61: v43.18,47.62 45.4,49.85 81.28,49.85 83.82,52.39 v83.82,52.7
GL_A  (via drill 0.5)
  Top 0.254: U$15.45 78.44,54.43 v78.42,54.61
  Top 0.61: R11.2 v13.02,27.3
  Bottom 0.61: v13.02,27.3 13.02,27.46 14.45,28.89 25.08,28.89 26.04,29.84 26.04,50.8 27.94,52.7 76.52,52.7 v78.42,54.61
GL_A'
  Top 0.61: R11.1 14.82,24.23 Q2.1
GL_B  (via drill 0.5)
  Top 0.254: U$15.40 80.94,52.1 82.55,53.71 v82.55,53.82
  Top 0.61: R16.2 v28.57,28.73
  Bottom 0.61: v28.57,28.73 28.57,28.89 40.32,28.89 41.59,30.16 41.59,48.58 43.81,50.8 79.53,50.8 v82.55,53.82
GL_B'
  Top 0.61: R16.1 30.38,24.23 Q4.1
GL_C  (via drill 0.5)
  Top 0.254: U$15.35 83.44,50.42 85.41,52.39 v85.41,52.7
  Top 0.61: R21.2 v44.13,28.73
  Bottom 0.61: v44.13,28.73 44.45,28.89 55.88,28.89 57.15,30.16 57.15,48.26 57.78,48.9 81.44,48.74 v85.41,52.7
GL_C'
  Top 0.61: R21.1 45.98,23.28 46.04,23.34 Q6.1
GND  (via drill 0.5, 0.7)
  Top 0.254: U$15.34 83.94,47.43 83.5,46.99 81.28,46.99 U$15.P$57 78.26,45.4 | C12.1 69.37,48.79 69.37,48.42 69.69,48.1 72.55,48.1 73.98,46.67 v77.15,46.67 | 35.72,13.71 R19.P$1 | 74.45,59.21 74.45,55.4 73.77,54.72 C16.2 | 73.66,64.14 v73.34,64.14 74.45,63.02 74.45,59.21 | U$15.7 U$15.8 76.44,43.42 v77.15,44.13 77.44,43.84 U$15.10 | R25.2 78.48,59 78.26,59.21 74.45,59.21 | R34.1 90.96,5.66 JP3.1 | C8.2 79.53,30.64 v79.85,30.32 | v68.58,44.77 R9.1 69.69,44.71 69.69,42.76 R8.1 C30.1 68.52,39.53 v68.52,37.31 C29.1 69.64,32.76 v72.07,30.32 | R30.1 62.81,13.34 v63.82,13.34 | v63.82,10.16 62.81,10.16 R32.1 | R28.1 63.4,16.61 v63.82,16.35 | 4.63,63.63 v4.6,63.82 | R26.1 C22.2 65.94,37.09 v65.88,37.31
  Top 0.305: C13.2 C21.2 87.84,47.42 | C20.2 87.79,47.47 | 69.37,48.79 68.26,48.79 C14.2
  Top 0.406: 25.72,9.84 v25.4,9.84 | C21.2 82.55,45.56 v82.23,46.67
  Top 0.61: Q6.7 Q6.6 Q6.5 Q6.3 Q6.2 | 87.84,47.42 C20.2 | v73.34,64.14 73.18,64.29 D1.A | C35.2 U1.GND | C26.2 57.47,48.26 | C28.2 26.35,29.53 27.3,28.57 27.3,27.3 26.35,26.35 26.35,12.38 v25.4,9.84 | C24.2 41.91,49.85 41.59,49.53 41.59,29.53 42.55,28.57 42.55,27.3 41.91,26.67 41.91,12.7 v40.64,9.84 | R2.1 63.66,45.72 64.61,44.77 v68.58,44.77
  Top 0.813: C7.2 C5.2 v3.02,29.21 | C1.2 C6.2 v3.02,45.4 | C2.2 4.63,63.63
  Top 1.016: 59.85,30.32 59.85,22.54
  Bottom 0.254: v79.85,30.32 v72.07,30.32 | 76.36,45.88 v77.15,46.67 | 76.52,44.77 v77.15,44.13 | v63.82,10.16 63.18,10.79 63.18,12.7 v63.82,13.34 63.18,13.97 63.18,15.72 v63.82,16.35 63.66,16.35 62.87,17.14 62.87,18.41 63.82,19.37 U1.GND1 | v4.6,63.82 3.81,63.18 3.81,55.24 C32.- | v65.88,37.31 68.52,37.15 v68.52,37.31
  Bottom 0.406: U1.GND2 81.6,20 82.55,20.95 | JP4.1 JP1.1
  Bottom 0.61: JP1.1 100.81,39.69 100.81,26.99 | 100.81,26.99 100.81,11.11 98.58,8.89 92.71,8.89 90.96,7.14 JP3.1 88.9,1.11 66.2,1.11 65.56,1.75 JP2.3 JP2.4 | U1.GND1 67.94,20.95 82.55,20.95 93.34,20.95 U1.GND 100.81,26.99 | 2.54,12.38 2.54,20.95 C33.- 3.02,22.38 v3.02,29.21 3.02,37.78 C31.- 3.49,38.73 3.02,39.21 v3.02,45.4 3.02,54.45 C32.- | v68.58,44.77 76.52,44.77
  Bottom 1.016: JP1.1 100.49,43.81 100.49,59.53 98.9,61.12 77.15,61.12 74.14,64.14 v73.34,64.14
  other vias: 31.75,3.17 38.1,3.17 44.45,3.17 55.88,12.7 12.7,9.84 25.4,7.3 55.88,22.86 48.26,14.92 48.26,17.46 50.8,14.92 50.8,17.46 45.72,12.38 43.18,9.84 48.26,12.38 79.69,46.67 79.69,44.13 78.42,44.13 80.96,44.13 82.23,44.13 80.96,46.67 78.42,46.67 55.88,17.78 25.4,3.17 18.73,3.17 12.7,3.17 12.7,7.3 15.24,9.84 15.24,7.3 17.78,9.84 20.32,9.84 22.86,9.84 17.78,7.3 20.32,7.3 22.86,7.3 27.94,9.84 27.94,7.3 30.48,7.3 33.02,7.3 30.48,9.84 33.02,9.84 35.56,9.84 38.1,9.84 35.56,7.3 38.1,7.3 40.64,7.3 43.18,7.3 45.72,9.84 50.8,20 48.26,20 3.17,12.7 85.72,43.18 16.83,13.18 21.27,13.18 32.23,13.18 36.67,13.18 56.83,7.62 56.83,2.54 63.5,45.72 63.5,40.64 58.42,63.5 58.42,68.58 58.42,73.66 100.01,7.94 74.61,58.42 65.41,58.74 65.41,63.5 63.5,73.66 68.58,73.66 73.66,73.66 78.74,73.66 83.82,73.66 88.9,73.66 100.01,68.58 100.01,63.5 97.79,57.15 95.25,57.15 19.05,13.18 34.45,13.18 60.64,45.72 60.64,40.64 60.64,35.56
  pour Top (isolate 0.61, rank 6, no thermals): -0.64,15.88 11.75,15.88 12.06,50.48 57.78,50.48 57.78,55.88 61.59,55.88 61.59,9.84 58.74,9.84 58.74,0 -0.64,0
  pour Top (no thermals): 46.99,27.94 46.99,21.59 46.99,18.41 55.24,18.41 55.24,27.94
  pour Bottom (isolate 0.305, rank 6, no thermals): 73.03,47.62 86.36,47.62 86.36,43.18 73.03,43.18
  pour Bottom (isolate 0.813, rank 6, no thermals): 0.95,67.94 50.8,68.1 50.8,62.23 61.91,62.23 61.91,24.45 57.78,20.48 57.78,0.16 0.79,0.16
  pour Bottom (isolate 0.406, rank 6, no thermals): 57.78,75.72 102.87,75.56 102.87,-0.64 62.87,-0.48 59.85,-0.48 58.74,-0.64 58.74,19.68 62.55,23.5 62.87,54.61 57.78,54.61
  pour Top (isolate 0.305, no thermals): 72.39,48.26 88.27,48.26 88.27,42.86 90.17,42.86 90.17,40.32 86.36,40.32 86.36,42.55 72.39,42.55
  pour Bottom (isolate 0.406, no thermals): 58.1,47.94 66.36,47.94 66.36,34.92 58.1,34.92
  pour Top (isolate 0.406, rank 6, no thermals): 57.78,75.56 101.92,75.56 101.92,-0.64 59.69,-0.64 59.69,20 62.55,22.86 62.55,59.05 57.78,59.05
H1  (via drill 0.5)
  Top 0.254: R24.1 v94.61,33.34 94.61,42.86 98.58,46.83 JP1.3
  Bottom 0.254: U1.2 94.61,29.84 v94.61,33.34
INH_A  (via drill 0.5)
  Top 0.254: U$15.17 80.94,32.68 80.49,32.23 v80.01,32.23 | v92.71,24.77 93.34,24.13 93.34,14.29 92.08,13.02 90.49,13.02 U1.22/A8
  Bottom 0.254: v92.71,24.77 84.14,24.77 82.87,26.04 82.87,28.73 80.96,30.64 80.64,30.64 80.01,31.27 v80.01,32.23
INH_B  (via drill 0.5)
  Top 0.254: U$15.19 81.94,31.14 80.33,29.53 80.01,29.53 79.69,29.21 79.69,28.1 80.33,27.46 v80.33,26.19
  Bottom 0.254: U1.9 75.09,25.88 80.01,25.88 v80.33,26.19
INH_C
  Top 0.254: U$15.21 82.94,30.55 81.6,29.21 U1.6
INL_A  (via drill 0.5)
  Top 0.254: U$15.18 81.44,31.91 v80.96,31.43 | v93.98,24.77 93.98,13.97 U1.23/A9
  Bottom 0.254: v80.96,31.43 83.98,28.42 84.61,28.42 85.41,27.62 85.41,26.35 86.04,25.72 93.03,25.72 v93.98,24.77
INL_B  (via drill 0.5)
  Top 0.254: U$15.20 82.44,31.01 80.64,29.21 v80.64,28.42
  Bottom 0.254: v80.64,28.42 72.87,28.42 U1.10
INL_C
  Top 0.254: U$15.22 83.44,30.1 82.87,29.53 82.87,22.54 85.41,20 85.41,16.19 84.14,14.92 U1.20/A6
ISENSE1
  Top 0.254: U$15.25 84.94,40.47 85.09,40.32 85.09,39.85 84.93,39.69 84.94,30.63 87.95,27.62 87.95,15.56 U1.A10
ISENSE2
  Top 0.254: U$15.26 85.44,40.6 85.57,40.48 85.57,39.69 85.41,39.53 85.44,31.08 87.95,28.57 89.53,28.57 90.49,27.62 90.49,13.97 89.53,13.02 87.95,13.02 U1.A11
N$1
  Top 0.61: 30.58,48.36 Q3.1 30.48,47.62 30.27,47.41 R15.1
N$2
  Top 0.254: 71.33,47.2 R3.1 R9.2 73.24,42.86 73.66,42.86 73.94,42.58 U$15.3
N$3
  Top 0.254: U$15.2 73.44,39.47 72.39,38.42 R7.2 C29.2
N$4
  Top 0.254: U$15.23 83.94,42.98 85.09,44.13 86.14,44.13 C10.1
  Top 0.305: 87.89,42.07 C10.1
N$5
  Top 0.61: 46.04,47.62 Q5.1 44.87,49.43 R20.1
N$6
  Top 0.254: C12.2 72.84,49.05 U$15.56
N$7
  Top 0.254: C30.2 71.33,40.22 70.8,39.69 70.48,39.69 69.85,39.05 69.85,38.63 R7.1
N$8
  Top 0.254: U$15.52 74.94,51.26 73.98,52.23 69.85,52.23 68.42,53.66 68.42,54.24 C15.1
N$9
  Top 0.254: Q1.1 14.92,47.62 | 12.8,46.99 R10.1
  Top 0.406: 13.23,47.62 R10.1
  Top 0.61: 13.23,47.62 14.92,47.62
N$10
  Top 0.254: R8.2 72.55,42.7 72.94,42.31 U$15.1
N$12
  Top 0.254: U$15.49 76.44,52.46 75.25,53.66 75.25,56.73 R25.1
N$13  (via drill 0.5)
  Top 0.254: v87,7.62 88.48,7.62 R33.1
  Top 0.406: R34.2 R33.1
  Bottom 0.254: U1.18/A4 79.06,11.59 80.49,10.16 83.82,10.16 86.36,7.62 v87,7.62
N$15
  Top 0.61: R14.P$3 23.18,15.08 25.24,17.14 R13.1
N$16
  Top 0.61: R19.P$3 38.58,14.92 40.64,16.99 R18.1
N$28
  Top 0.254: U$15.38 81.94,50.83 82.71,51.59 82.71,52.86 83.34,53.5 83.34,55.82 C19.1
  Top 0.305: 83.19,55.98 C19.1
N$30
  Top 0.254: U$15.14 79.44,34.67 78.42,33.66 77.47,33.66 77.15,33.34 77.15,32.92 C9.1
N$31
  Top 0.254: 86.52,40.16 87.15,40.16
  Top 0.305: U$15.27 85.94,40.74 86.52,40.16 | 86.62,40.16 87.15,40.16 C11.1
N$32
  Top 0.254: U$15.15 79.94,34.54 78.74,33.34 78.74,32.8 C9.2
N$33
  Top 0.254: U$15.13 78.94,34.81 78.26,34.13 76.36,34.13 75.88,33.66 75.88,31.69 C8.1
N$34
  Top 0.254: U$15.43 79.44,52.93 80.01,53.5 80.01,55.98
  Top 0.305: 80.01,55.98 C18.1
N$44
  Top 0.254: U$15.48 76.94,53.07 75.88,54.13 75.88,55.14 C17.1
N$47
  Top 0.254: U$15.51 U$15.50 75.72,49.37 | C15.2 70.06,54.87 | 67.94,56.99 67.94,58.62 L1.1 | 67.51,63.63 D1.C
  Top 0.61: C15.2 71.49,52.86 74.61,52.86 75.72,51.75 75.72,49.37 | 70.06,54.87 67.94,56.99 | L1.1 67.51,63.63
OCTW  (via drill 0.5)
  Top 0.254: U$15.5 74.94,37.13 74.92,37.13 74.77,36.99 v74.77,29.21 | v69.37,28.89 69.06,28.89 67.63,27.46 67.63,20.64 U1.28
  Bottom 0.254: v74.77,29.21 69.69,29.21 v69.37,28.89
PWRGD
  Top 0.254: U$15.4 74.44,37.3 74.3,37.15 74.3,29.84 73.98,29.53 73.98,28.89 74.61,28.26 75.25,28.26 U1.8
  Top 0.406: U1.8 R6.1
RX1
  Bottom 0.254: U1.0 100.01,30.16 100.01,32.86 JP4.2
SL_A  (via drill 0.5, 0.7)
  Top 0.254: 78.9,49.11 U$15.44 78.94,53.54 v79.22,53.82 | v87.31,54.93 88.11,55.72 v91.12,55.72 | 90.96,55.88 R12.1
  Top 0.305: v91.12,55.72 90.96,55.88
  Top 0.406: Q2.7 22.54,25.72 22.76,25.93 22.76,25.61
  Top 0.61: Q2.7 Q2.6 | Q2.6 Q2.5 Q2.3 Q2.2 | 21.27,22.23 Q2.6
  Bottom 0.254: v79.22,53.82 80.01,54.61 87,54.61 v87.31,54.93
  Bottom 0.305: v91.12,55.72 90.96,55.4 90.96,51.12 88.9,49.05 88.9,39.21 87.15,37.47 72.71,37.47 61.28,26.04 23.5,26.04 21.27,23.81 v21.27,20.48
  Bottom 0.406: 18.1,21.59 v19.05,20.48
  other vias: 16.83,20.48
  pour Top (isolate 0.305, rank 4, no thermals): 23.5,27.3 23.5,18.1 15.88,18.1 15.88,27.3
  pour Bottom: 15.88,24.77 22.23,24.77 22.23,18.1 15.88,18.1
SL_B  (via drill 0.5, 0.7)
  Top 0.254: 38.95,26.25 39.05,26.35 39.05,25.08 Q4.7 | U$15.39 81.44,51.44 v81.92,51.91
  Top 0.305: Q4.7 38.1,23.81 38.42,24.13 | v88.11,51.28 90.49,48.9 v90.65,48.9 91.76,48.9 93.34,50.48 R17.1
  Top 0.406: 39.05,26.35 v34.45,20.48
  Top 0.61: Q4.7 Q4.6 | Q4.6 Q4.5 | Q4.3 Q4.2 | Q4.6 36.83,19.68
  Bottom 0.254: v81.92,51.91 83.5,53.5 85.88,53.5 v88.11,51.28
  Bottom 0.305: v90.65,48.9 89.85,48.1 89.85,38.58 87.79,36.51 73.34,36.51 61.59,24.77 37.47,24.77 Q4.6 36.83,21.11 v36.67,20.48
  other vias: 32.23,20.48
  pour Top (isolate 0.305, rank 4, no thermals): 39.05,27.3 39.05,18.1 31.43,18.1 31.43,27.3
  pour Bottom: 31.43,24.77 37.78,24.77 37.78,18.1 31.43,18.1
SN1
  Top 0.254: U$15.33 84.45,49.16 84.45,50.64 88.74,54.93 91.6,54.93 92.23,55.56 92.23,58.32 92.08,58.48 | 92.08,58.48 R12.2 90.75,58.26 | 92.08,58.48 C25.1
SN2
  Top 0.254: R17.2 C27.1 | U$15.31 85.44,50.36 87.79,52.7 90.01,52.7 90.17,52.86 90.17,53.34 90.39,53.55 C27.1 | 90.91,53.5 C27.1
SP1  (via drill 0.5)
  Top 0.254: U$15.32 84.93,49.16 84.93,50.48 88.9,54.45 92.08,54.45 v93.34,55.72 | C25.2 93.34,56.52
  Top 0.305: v93.34,55.72 C25.2
  Top 0.406: R13.2 25.24,20.16 24.61,20.8 v24.61,25.24
  Bottom 0.305: v93.34,55.72 92.23,54.61 92.23,51.59 89.38,48.74 89.38,38.89 87.47,36.99 73.03,36.99 61.44,25.4 24.77,25.4
  Bottom 0.406: v24.61,25.24 24.77,25.4
SP2  (via drill 0.5)
  Top 0.254: U$15.30 85.94,50.22 87.95,52.23 90.17,52.23 90.54,51.85 C27.2 90.91,51.91
  Top 0.305: C27.2 90.96,51.28 91.6,50.64 v91.6,49.85
  Top 0.406: R18.2 40.64,20.16 40.01,20.8 v40.01,23.81
  Bottom 0.305: v40.01,23.81 40.32,24.13 61.75,24.13 73.66,36.04 88.11,36.04 90.33,38.26 90.33,47.78 90.65,48.1 91.12,48.1 91.6,48.58 v91.6,49.85
THRO
  Top 0.254: R33.2 88.42,5.66 JP3.2
TNSY_A12  (via drill 0.5)
  Top 0.254: v82.87,15.56 82.87,7.78 JP2.16
  Bottom 0.254: U1.A12 82.87,18.1 v82.87,15.56
TNSY_P24
  Top 0.254: U1.24 79.06,19.05 80.33,17.78 80.33,7.78 JP2.14
TNSY_P25
  Top 0.254: U1.25 76.52,19.05 77.79,17.78 77.79,7.78 JP2.12
TNSY_P26  (via drill 0.5)
  Top 0.254: v74.45,15.24 74.45,13.18 75.25,12.38 75.25,7.78 JP2.10
  Bottom 0.254: U1.26 75.25,18.1 75.25,16.03 v74.45,15.24
TNSY_P27
  Top 0.254: U1.27 72.71,18.1 72.71,13.65 72.39,13.34 72.39,12.54 72.71,12.22 72.71,7.78 JP2.8
TNSY_P28  (via drill 0.5)  (1 unrouted)
  Top 0.254: v70.17,15.72 70.17,15.56 69.69,15.08 69.69,12.7 70.17,12.22 70.17,7.78 JP2.6
  Bottom 0.254: 70.17,18.26 v70.17,15.72 70.17,15.56
TNSY_P29
  Top 0.254: U1.29 68.9,13.49 67.63,12.22 67.63,11.27 68.58,10.32 68.58,8.57 66.83,6.83 66.83,4.45 JP2.5
TNSY_P30  (via drill 0.5)
  Top 0.254: U1.30 71.44,14.13 v70.48,13.18
  Bottom 0.254: v70.48,13.18 70.17,12.86 70.17,8.1 71.91,6.35 71.91,4.45 JP2.7
TNSY_P31  (via drill 0.5)
  Top 0.254: U1.31 73.18,16.03 v73.18,13.02
  Bottom 0.254: v73.18,13.02 72.71,12.54 72.71,8.1 74.45,6.35 74.45,4.45 JP2.9
TNSY_P32
  Bottom 0.254: U1.32 76.52,15.72 75.25,14.45 75.25,8.1 76.99,6.35 76.99,4.45 JP2.11
TNSY_P33
  Bottom 0.254: U1.33 77.79,15.56 77.79,8.26 79.53,6.51 79.53,4.45 JP2.13
TX1
  Bottom 0.254: U1.1 94.3,27.46 94.93,28.1 97,28.1 98.58,29.69 JP4.3
VDD  (via drill 0.5, 0.7)
  Top 0.254: C26.1 57.76,52.84 | R1.2 63.66,57.15 63.98,57.47 | U$15.54 U$15.53 | U$15.54 73.94,49.09 74.14,48.9 | U$15.54 73.94,48.86 74.14,49.05
  Top 0.305: C13.1 C21.1 89.64,47.42 | 89.38,47.68 C20.1 89.69,47.57 89.69,48.1 88.64,49.15 U$15.29 86.52,49.23 86.52,49.85 87,50.32 v87.15,50.32
  Top 0.406: 74.14,48.9 74.14,48.1 v74.45,47.78
  Top 0.61: Q5.4 Q3.4 | Q3.4 Q1.4 15.43,59.05 | Q3.4 30.98,59.05 C28.1 | Q5.4 46.54,59.05 C24.1 | 89.64,47.42 C20.1 | C33.+ C31.+ C32.+ | 50.48,58.42 Q5.4 | v53.66,56.2 55.88,59.05 62.39,59.05 63.98,57.47 66.36,55.09 66.36,52.39 67.68,51.06 C14.1 73.39,51.06 74.14,50.32 74.14,49.05
  Bottom 0.406: v74.45,47.78 74.61,47.94 84.77,47.94 v87.15,50.32
  other vias: 38.1,61.91 38.1,56.2 38.1,59.05 34.29,56.2 34.29,59.05 34.29,61.91 36.2,61.91 36.2,59.05 36.2,56.2 32.38,56.2 32.38,59.05 32.38,61.91 30.48,61.91 30.48,59.05 30.48,56.2 46.04,56.2 46.04,59.05 46.04,61.91 47.94,61.91 47.94,59.05 47.94,56.2 49.85,56.2 49.85,59.05 49.85,61.91 51.75,61.91 51.75,59.05 51.75,56.2 53.66,59.05 53.66,61.91 22.54,56.2 22.54,59.05 22.54,61.91 20.64,61.91 20.64,59.05 20.64,56.2 18.73,56.2 18.73,59.05 18.73,61.91 14.92,56.2 14.92,59.05 14.92,61.91 16.83,56.2 16.83,59.05 16.83,61.91 12.7,64.77 15.24,64.77 17.78,64.77 20.32,64.77 22.86,64.77 25.4,64.77 27.94,64.77 30.48,64.77 33.02,64.77 35.56,64.77 38.1,64.77 40.64,64.77 43.18,64.77 45.72,64.77 48.26,64.77 12.7,67.31 15.24,67.31 17.78,67.31 20.32,67.31 22.86,67.31 25.4,67.31 27.94,67.31 30.48,67.31 33.02,67.31 35.56,67.31 38.1,67.31 40.64,67.31 43.18,67.31 45.72,67.31
  pour Top (isolate 0.813, no thermals): 56.83,75.88 56.83,52.39 6.67,52.39 6.67,56.2 -0.64,56.2 -0.64,75.88
  pour Bottom (isolate 0.406): 56.2,67.94 56.2,54.29 11.43,54.29 11.43,67.94
  pour Top (isolate 0.813, no thermals): -1.27,56.52 11.11,56.52 11.11,20.32 9.21,17.78 -1.27,17.78
  pour Top (isolate 0.406, rank 5, no thermals): 56.67,60.64 64.14,60.64 64.14,57.78 56.67,57.78
VSENSE  (via drill 0.5)
  Top 0.254: R1.1 R2.2 64.71,49.43 66.99,47.15 v66.99,45.88 | v73.82,23.18 73.82,21.27 75.25,19.84 75.25,13.02 U1.17/A3 | v66.99,41.75 66.99,29.37 65.25,27.62 65.25,23.5 v65.56,23.18
  Bottom 0.254: v65.56,23.18 v73.82,23.18 | v66.99,45.88 v66.99,41.75
(copper drawn outside any net)
  shapes: Bottom circle x6, Top circle x6